# Altium schematic sheet Guide_laser.SchDoc
size 420 x 297 mm; Address1: Address1; Address2: Address2; Address3: Address3; Address4: Address4; DocumentNumber: *Э3; SheetNumber: 6; SheetTotal: 11; DocumentType: Схема электрическая *
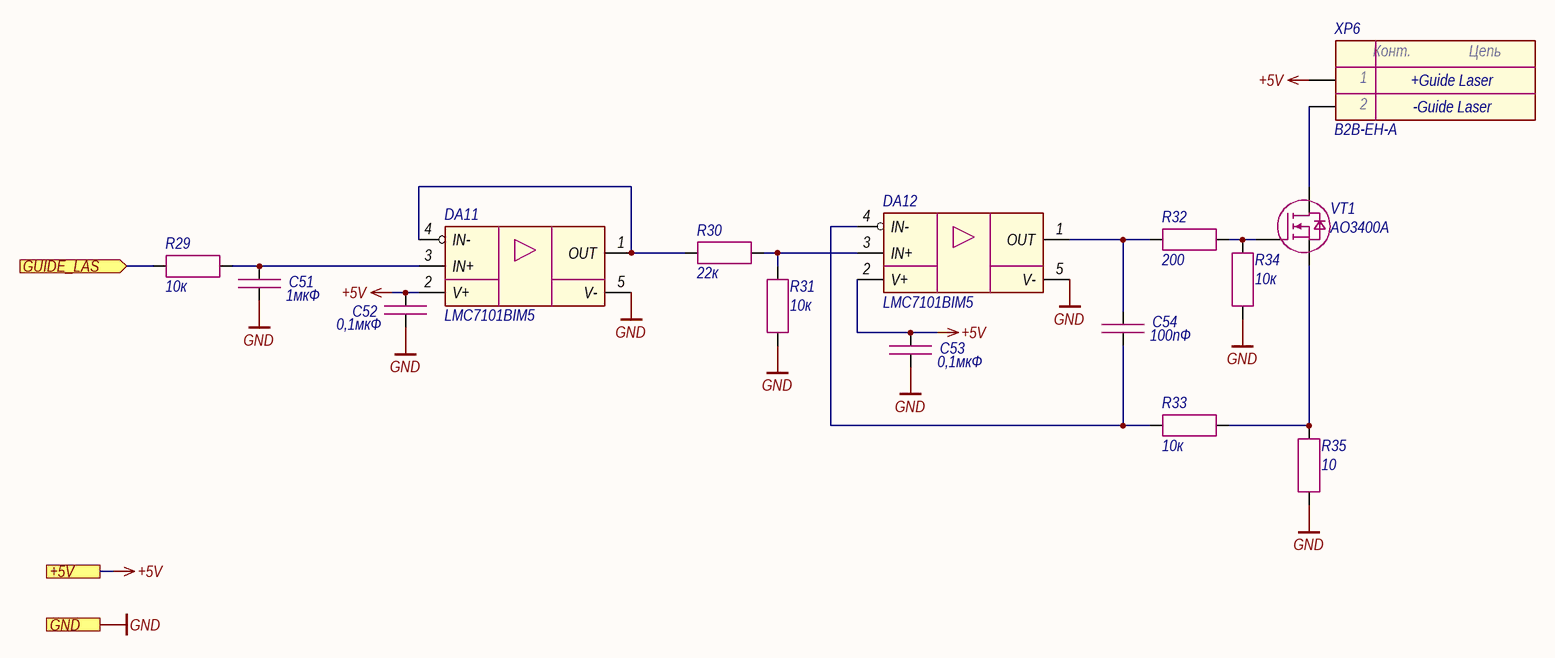
[diagram p0: Guide_laser.SchDoc]

## Parts
C51  1мкФ  [CAP_0603]
C52  0,1мкФ  [CAP_0603]
C53  0,1мкФ  [CAP_0603]
C54  100пФ  [CAP_0603]
DA11  LMC7101BIM5  [SOT-23-5]
DA12  LMC7101BIM5  [SOT-23-5]
R29  10к  [RES_0603]
R30  22к  [RES_0603]
R31  10к  [RES_0603]
R32  200  [RES_0603]
R33  10к  [RES_0603]
R34  10к  [RES_0603]
R35  10  [RES_1210]
VT1  AO3400A  [SOT-23-3]
XP6  B2B-EH-A  [B2B-EH-A]

## Ports
+5V (see Main[2A]), GND (see Main[2A], Ethernet[3D], Fiber_interlock[2C], Hardwiring[3D], Indication[1C], LD_driver[1D], Power_supply[2D], Protection[2C]), GUIDE_LAS (in, see Main[2A])

## Nets
+5V: C52.1 C53.1 DA11.2(V+) DA12.2(V+) XP6.1 ; port +5V
GND: C51.2 C52.2 C53.2 DA11.5(V-) DA12.5(V-) R31.2 R34.1 R35.1 ; port GND
GUIDE_LAS: R29.1 ; port GUIDE_LAS
NetC51_1: C51.1 DA11.3(IN+) R29.2
NetC54_1: C54.1 DA12.1(OUT) R32.1
NetC54_2: C54.2 DA12.4(IN-) R33.1
NetDA11_1: DA11.1(OUT) DA11.4(IN-) R30.1
NetDA12_3: DA12.3(IN+) R30.2 R31.1
NetR32_2: R32.2 R34.2 VT1.1(G)
NetR33_2: R33.2 R35.2 VT1.2(S)
NetVT1_3: VT1.3(D) XP6.2

## Notes on the sheet
- +Guide Laser
- -Guide Laser
- Подп. и дата
- Инв. № дубл.
- Взам. инв. №
- Инв. № подл.
- Изм.
- Лист
- № докум.
- Подп.
- Дата
- Копировал
- Формат А3
- (in symbol Connector-2) Конт.; Цепь

## Library data of the parts
C51 = Capacitor: Manufacturer: Murata; Model: GRM188R61H105KAALD; Value: 1мкФ; Document: *
C52 C53 = Capacitor: Manufacturer: Murata; Model: GRM188R71H104KA93D; Value: 0,1мкФ; Document: *
C54 = Capacitor: Manufacturer: Murata; Model: GRM1885C1H101JA01D; Value: 100пФ; Document: *
DA11 DA12 = LMC7101: Manufacturer: Texas Instruments; Model: LMC7101BIM5; Document: *
R29 R31 R33 R34 = Resistor: Manufacturer: Yageo; Model: RC0603FR-0710KL; Value: 10к; Document: *
R30 = Resistor: Manufacturer: Yageo; Model: RC0603FR-0722KL; Value: 22к; Document: *
R32 = Resistor: Manufacturer: Yageo; Model: RC0603FR-07200RL; Value: 200; Document: *
R35 = Resistor: Manufacturer: Yageo; Model: RC1210FR-0710RL; Value: 10; Document: *
VT1 = MOSFET N-channel: Manufacturer: UMW; Model: AO3400A; Document: *
XP6 = Connector-2: Manufacturer: JST; Model: B2B-EH-A; Document: *